# Altium schematic sheet PG14_ Ethernet.SchDoc
size 420 x 297 mm
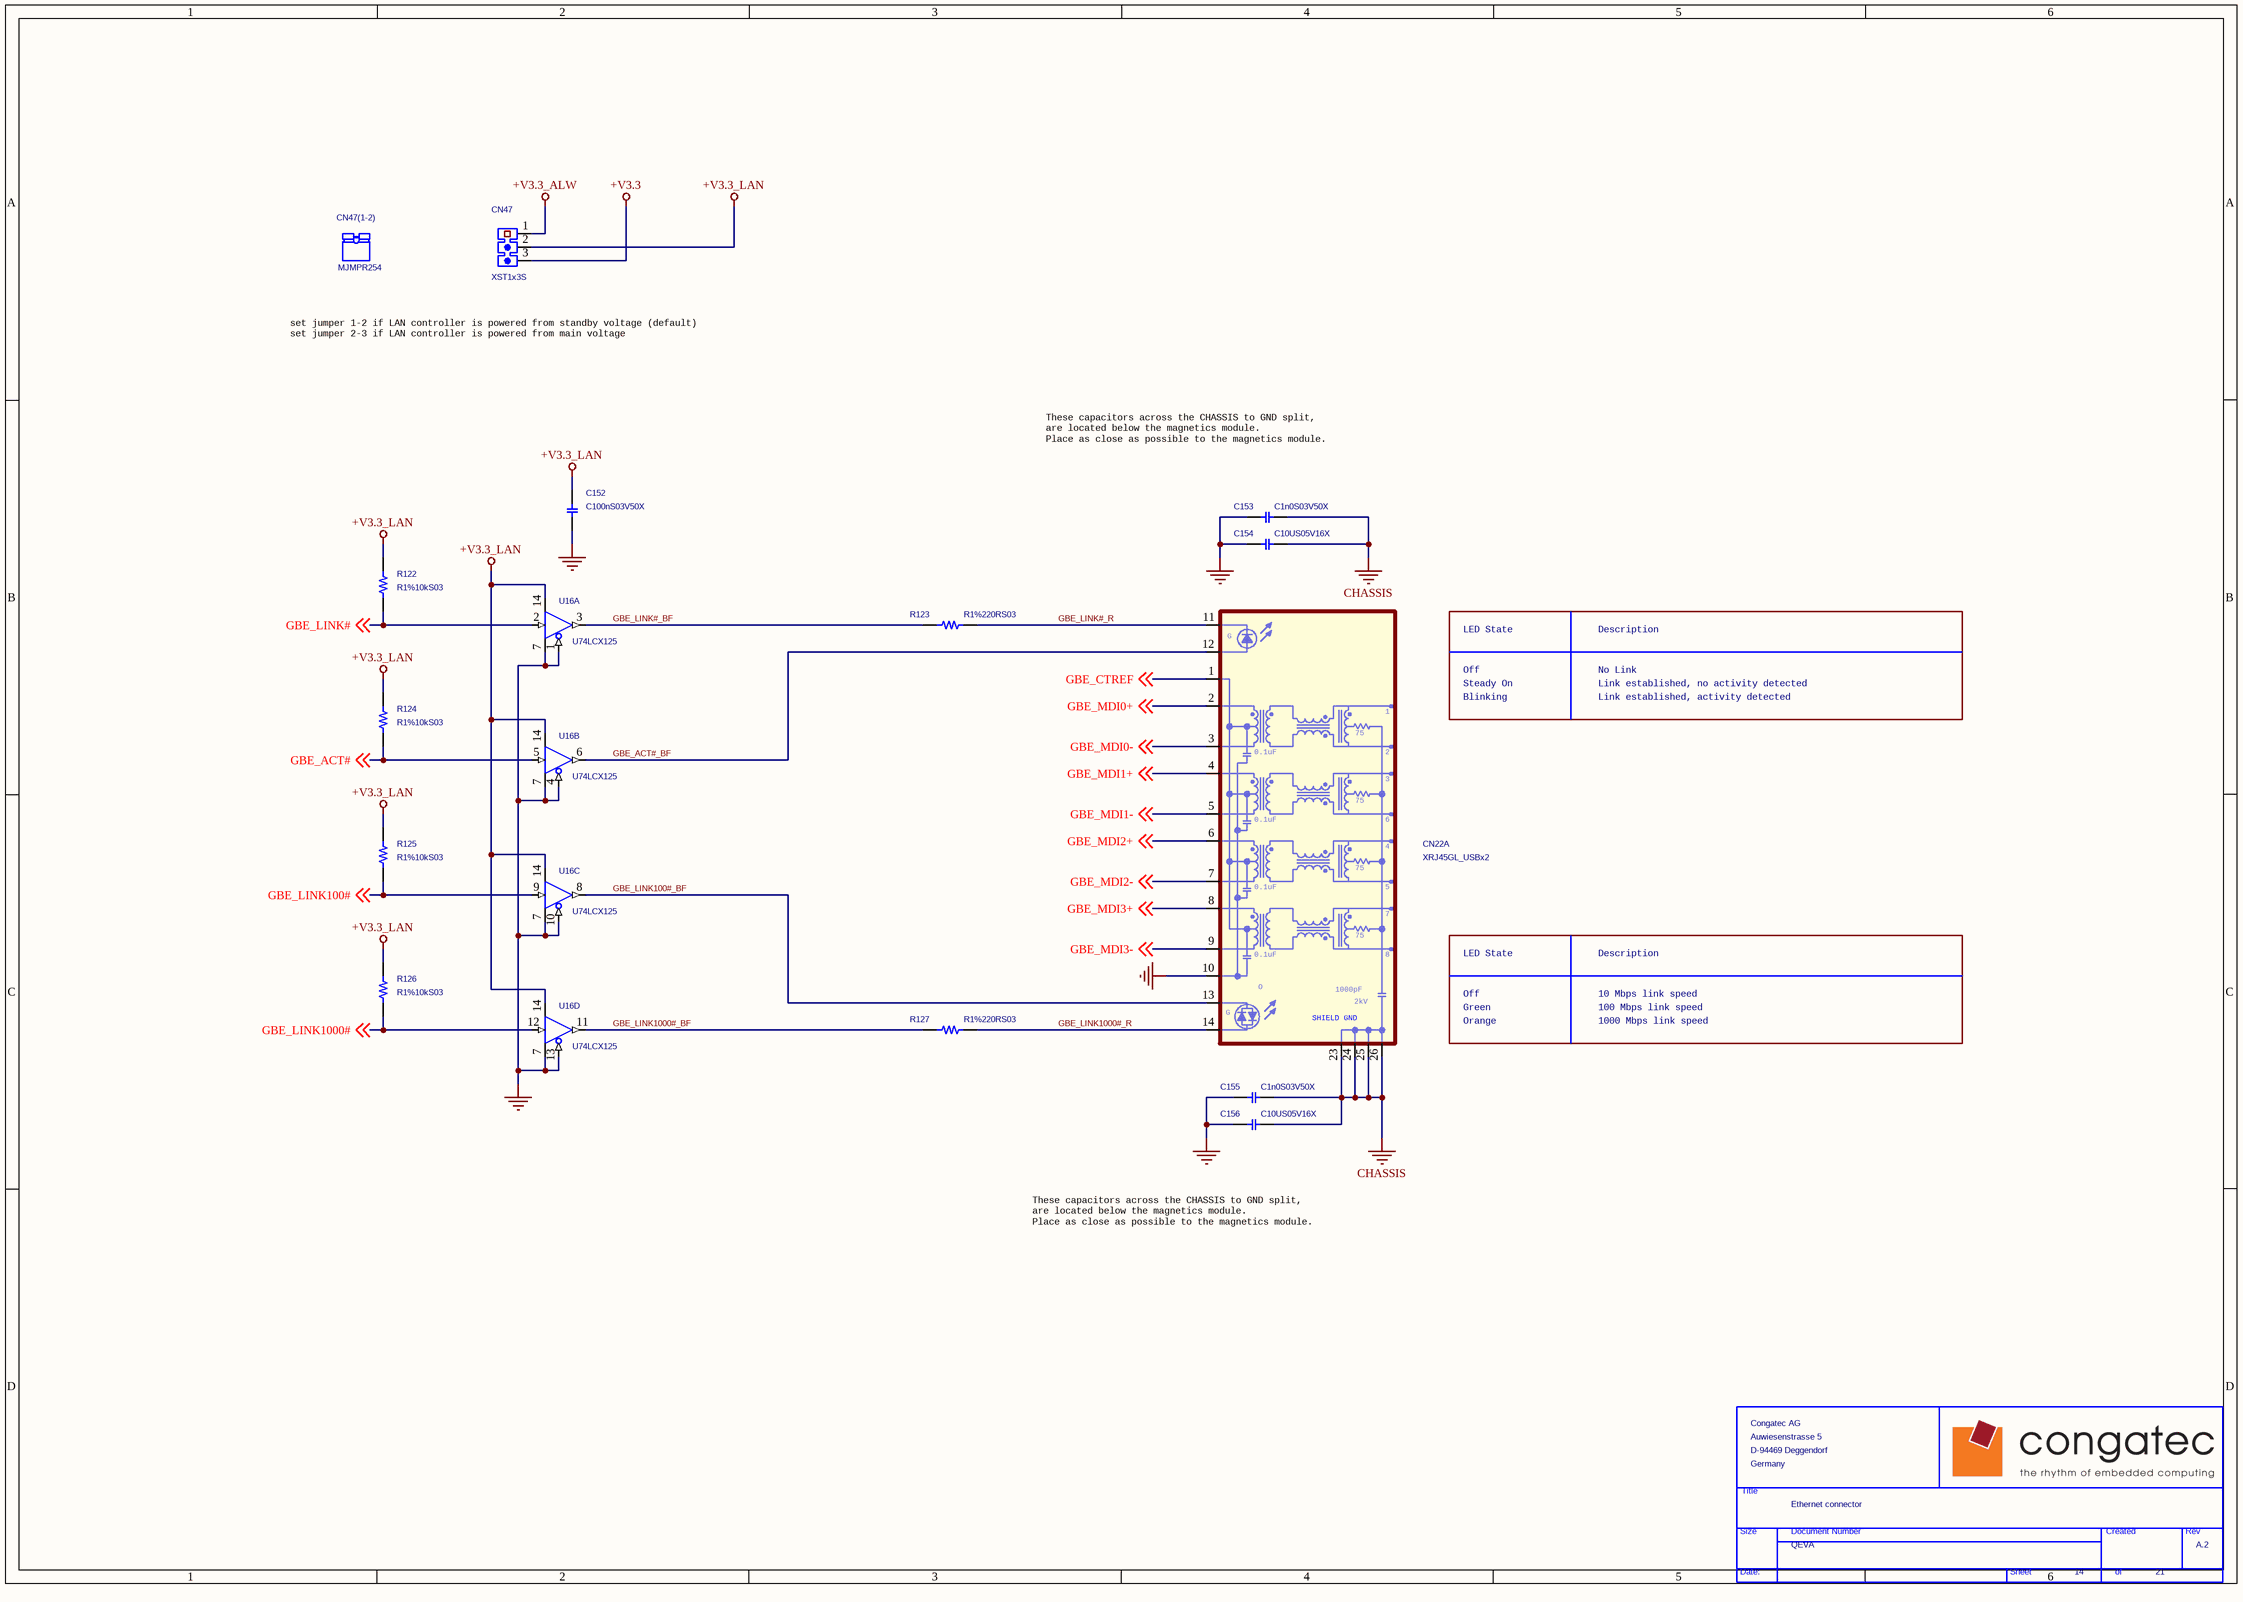
[diagram p0: PG14_ Ethernet.SchDoc]

## Parts
*  Page Count: 21  Page Number: 14  Title: Ethernet connector  RevCode: A.2  Doc: QEVA  OrgName: Congatec AG  OrgAddr1: Auwiesenstrasse 5  OrgAddr2: D-94469 Deggendorf  OrgAddr3: Germany  (hidden comment: TitleBlock_CONGA)  (graphical)
C152  C100nS03V50X  [C0603]
C153  C1n0S03V50X  [C0603]
C154  C10US05V16X  [C0805]
C155  C1n0S03V50X  [C0603]
C156  C10US05V16X  [C0805]
CN22  XRJ45GL_USBx2  [RJ45-P3515619W9]  (part A of 3)
CN47  XST1x3S  [JH3X1V]
CN47(1-2)  MJMPR254
R122  R1%10kS03  [R0603]
R123  R1%220RS03  [R0603]
R124  R1%10kS03  [R0603]
R125  R1%10kS03  [R0603]
R126  R1%10kS03  [R0603]
R127  R1%220RS03  [R0603]
U16  U74LCX125  [SOIC14]  (parts A,B,C,D of 4)

## Nets
+V3.3: CN47.3
+V3.3_ALW: CN47.1
+V3.3_LAN: C152.1 CN47.2 R122.1 R124.1 R125.1 R126.1 U16.14(VCC)
CHASSIS: C153.2 C154.2 C155.2 C156.2 CN22.23(GND_1) CN22.24(GND_2) CN22.25(GND_3) CN22.26(GND_4)
GND: C152.2 C153.1 C154.1 C155.1 C156.1 CN22.10(TCT2) U16.1(1OE) U16.4(2OE) U16.7(GND) U16.10(3OE) U16.13(4OE)
GBE_ACT#: R124.2 U16.5(2A) ; off-sheet GBE_ACT#
GBE_ACT#_BF: CN22.12(ACT+) U16.6(2Y)
GBE_CTREF: CN22.1(TCT1) ; off-sheet GBE_CTREF
GBE_LINK100#: R125.2 U16.9(3A) ; off-sheet GBE_LINK100#
GBE_LINK100#_BF: CN22.13(LINK1) U16.8(3Y)
GBE_LINK1000#: R126.2 U16.12(4A) ; off-sheet GBE_LINK1000#
GBE_LINK1000#_BF: R127.1 U16.11(4Y)
GBE_LINK1000#_R: CN22.14(LINK2) R127.2
GBE_LINK#: R122.2 U16.2(1A) ; off-sheet GBE_LINK#
GBE_LINK#_BF: R123.1 U16.3(1Y)
GBE_LINK#_R: CN22.11(ACT-) R123.2
GBE_MDI0+: CN22.2(0+) ; off-sheet GBE_MDI0+
GBE_MDI0-: CN22.3(0-) ; off-sheet GBE_MDI0-
GBE_MDI1+: CN22.4(1+) ; off-sheet GBE_MDI1+
GBE_MDI1-: CN22.5(1-) ; off-sheet GBE_MDI1-
GBE_MDI2+: CN22.6(2+) ; off-sheet GBE_MDI2+
GBE_MDI2-: CN22.7(2-) ; off-sheet GBE_MDI2-
GBE_MDI3+: CN22.8(3+) ; off-sheet GBE_MDI3+
GBE_MDI3-: CN22.9(3-) ; off-sheet GBE_MDI3-

## Notes on the sheet
- set jumper 1-2 if LAN controller is powered from standby voltage (default)
  set jumper 2-3 if LAN controller is powered from main voltage
- These capacitors across the CHASSIS to GND split,
  are located below the magnetics module.
  Place as close as possible to the magnetics module.
- LED State
- Description
- Off
- Steady On
- Blinking
- No Link
- Link established, no activity detected
- Link established, activity detected
- 10 Mbps link speed
- Green
- Orange
- 100 Mbps link speed
- 1000 Mbps link speed
- (in symbol 1652_RJ45-P3515619W9_0, part A) G; 75; 0.1uF; O; 1000pF; 2kV; SHIELD GND
- (in symbol TitleBlock_CONGA) Title; Size; Document Number; Created; Rev; Date:; Sheet; of

## Library data of the parts
C152 = 11_C_0: CAP 0.1U 50V +-10% SMD 0603 X7R WO/Pb; Manufacture Part Number: C1608X7R1H104KT試223858615649; Part Number: 1100000214; Part_Number: 41000289; ProcessType: SMT; Tolerance: 10%; BOM_Level: 1; Package: 0603; Revision: A
C153 C155 = 11_C_0: CAP 1000pF 50V 10% 0603 MLCC; Part Number: 1124510290; Manufacture Part Number: 2238 586 15623試C1608X7R1H102K試2238 586 15623; Part_Number: 41000292; ProcessType: SMT; BOM_Level: 1; Tolerance: 10%; Package: 0603; Revision: A
C154 C156 = 11_C_0: CAP 10u 6.3V +/-10% SMD 0805 MLCC X5R KEMET; Manufacture Part Number: C0805C106K9PAC; Part Number: 1100000316; Part_Number: 41000185; ProcessType: SMT; Tolerance: 10%; BOM_Level: 1; Package: 0805; Revision: A
CN22 = 1652_RJ45-P3515619W9_0: PhoneJack RJ45+USB*2 90D(F) W/LED&XFMR DIP; Part NUmber: 165250820M; Part_Number: 41500328; Manufacture Part Number: P25@156-P9W9; BOM_Level: 1; Revision: A; ProcessType: DIP; Package: RJ45+USBx2+XFMR
CN47 = 1653_JH3X1V_0: PIN HEADER 3*1P 180D(M) 2.54mm DIP WO/Pb; Part Number: 1653003100; Manufacture Part Number: 205-1x3GS RoHS試1130-000-03S試21N12564-03S10B-01G-6/3; Part_Number: 41500141; BOM_Level: 1; Package: PH3x1P-2.54; ProcessType: DIP; Revision: A
CN47(1-2) = 1653_MINIJUMPER22.54MM_0: MINI JUMPER 2P 180D(F) 2.54mm DIP (yellow); Manufacture Part Number: 1132-040-02試HL0305302試MJ1P-BG0L試151-240-00000306; Part Number: 1653300100; Part_Number: 49000001; BOM_Level: 1; ProcessType: DIP; Package: MINIJUMPER2P-2.54; Revision: A
R122 R124-R126 = 10_R_0_Dup1: R 10K 1/10W 1% SMD 0603 CR WO/Pb; Part_Number: 45502052; Part Number: 105A510023; Manufacture Part Number: RCT02***FTP試0603WAF1002T5E試2322 704 61003L試RC0603FR-0710KL試RM06FTN1002試WR06X8200JT; BOM_Level: 1; ProcessType: SMT; Revision: A; Tolerance: 1%; Package: 0603
R123 = 10_R_0_Dup1: 220 1/10W 5% 0603 CR WO/Pb; Part_Number: 45502013; Manufacture Part Number: 0603WAJ0221T5E試232270260221L試RM06JTN221; Part Number: 105A722009; BOM_Level: 1; ProcessType: SMT; Revision: A; Package: 0603; Tolerance: 5%
R127 = 10_R_0_Dup1: 220 1/10W 5% 0603 CR WO/Pb; Manufacture Part Number: 0603WAJ0221T5E試232270260221L試RM06JTN221; Part Number: 105A722009; Part_Number: 45502013; ProcessType: SMT; BOM_Level: 1; Package: 0603; Tolerance: 5%; Revision: A
U16 = 14S_TI_SN74LVC125ADT_SOIC14_1: IC SMD SN74LVC125ADT SOIC 14P TI; Part_Number: 43000421; Part Number: 14S5A12500; BOM_Level: 1; ProcessType: SMT; Revision: A; Manufacture Part Number: SN74LVC125ADT; Package: SOIC14
* = TitleBlock_CONGA: Page Create Date: March  8, 1995